# EAGLE schematic RCR2 (EAGLE 9.5.2)
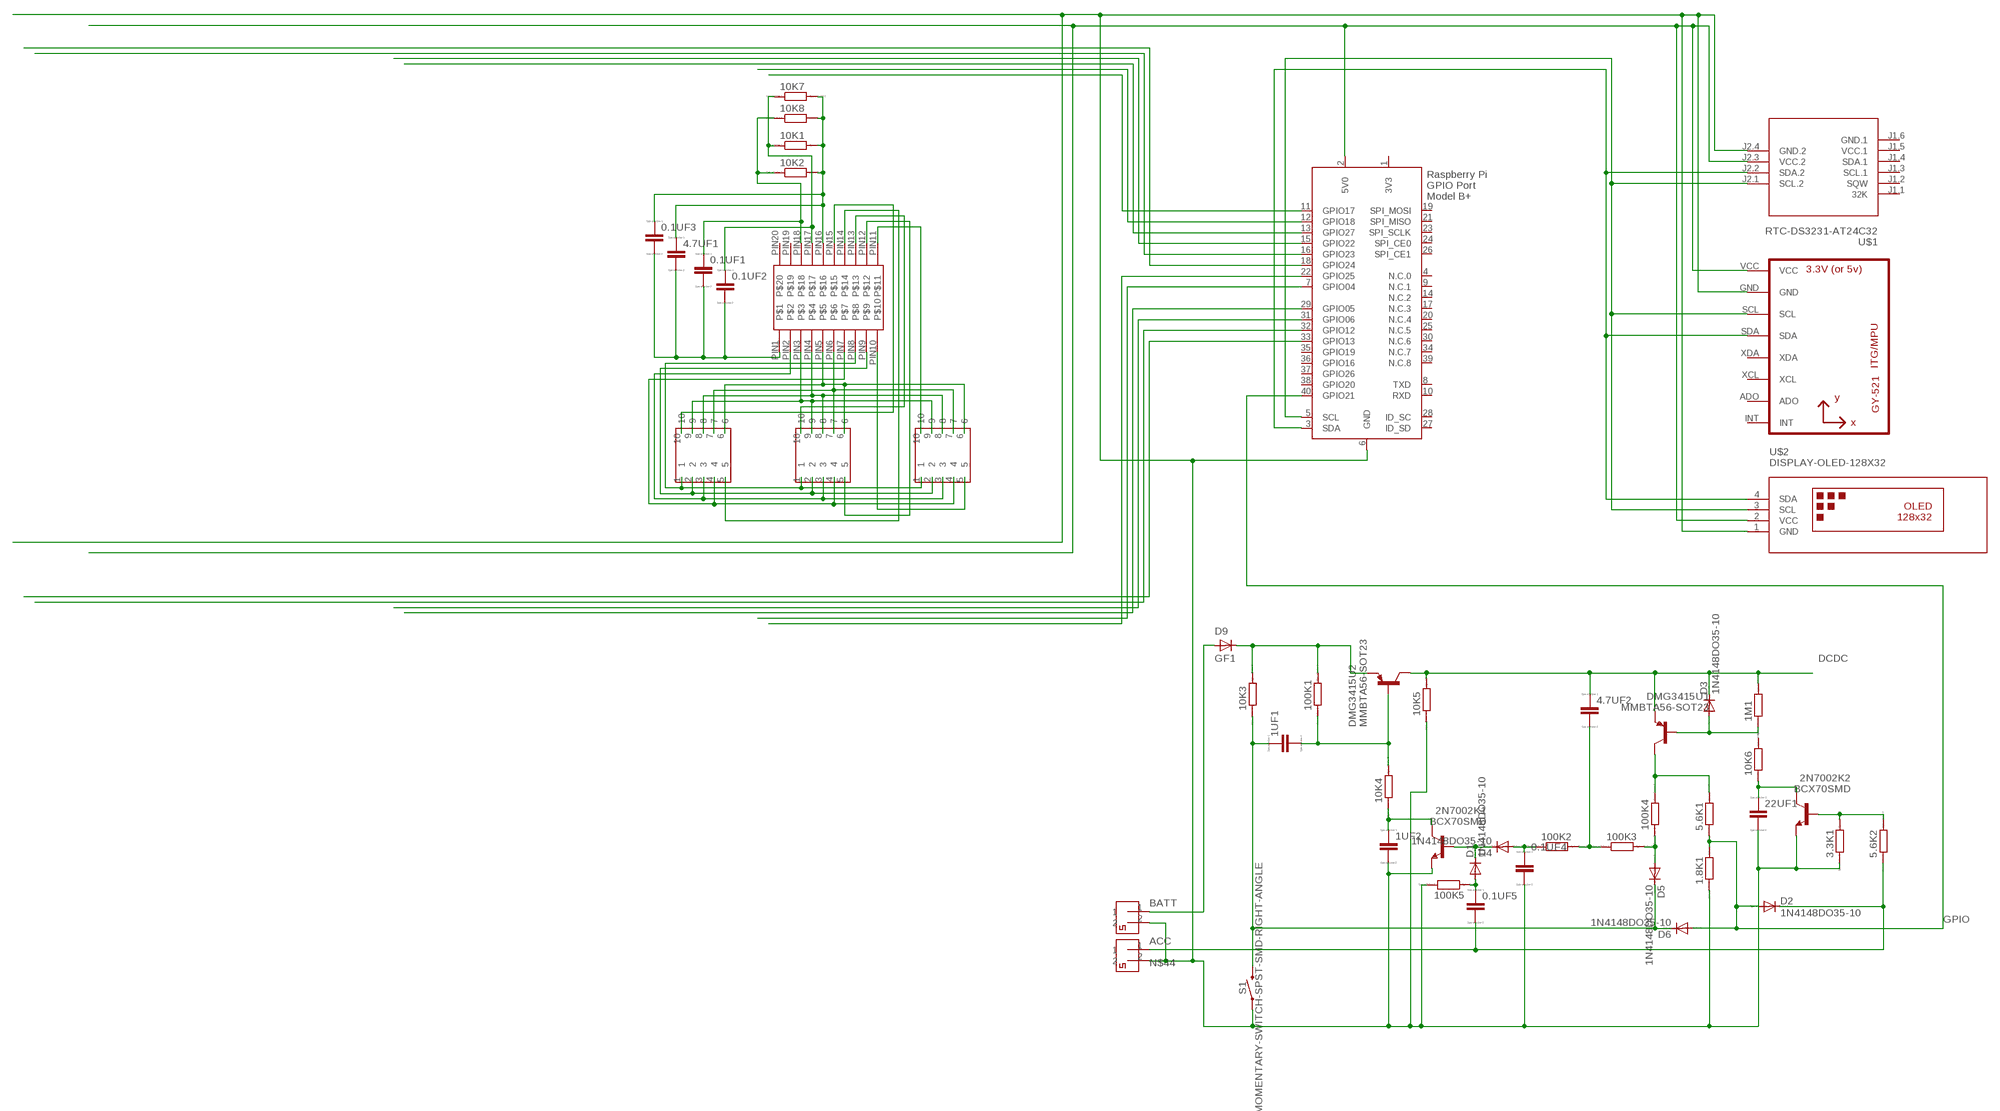
[diagram p0: schematic, sheet 1]

## Parts
0.1UF1  CC1206  [C1206]
0.1UF2  CC1206  [C1206]
0.1UF3  CC1206  [C1206]
0.1UF4  CC1206  [C1206]
0.1UF5  CC1206  [C1206]
1.8K1  RR1206  [R1206]
1M1  RR1206  [R1206]
1UF1  CC0603  [C0603]
1UF2  CC0603  [C0603]
2N7002K1  BCX70SMD  [SOT23]
2N7002K2  BCX70SMD  [SOT23]
3.3K1  RR1206  [R1206]
4.7UF1  CC2012  [C2012]
4.7UF2  CC2012  [C2012]
5.6K1  RR1206  [R1206]
5.6K2  RR1206  [R1206]
10K1  RR1206  [R1206]
10K2  RR1206  [R1206]
10K3  RR1206  [R1206]
10K4  RR1206  [R1206]
10K5  RR1206  [R1206]
10K6  RR1206  [R1206]
10K7  RR1206  [R1206]
10K8  RR1206  [R1206]
22UF1  C  [C0805]
100K1  RR1206  [R1206]
100K2  RR1206  [R1206]
100K3  RR1206  [R1206]
100K4  RR1206  [R1206]
100K5  RR1206  [R1206]
CONNECTOR2  2PIN  [2PIN]
CONNECTOR3  2PIN  [2PIN]
D1  1N4148DO35-10  [DO35-10]
D2  1N4148DO35-10  [DO35-10]
D3  1N4148DO35-10  [DO35-10]
D4  1N4148DO35-10  [DO35-10]
D5  1N4148DO35-10  [DO35-10]
D6  1N4148DO35-10  [DO35-10]
D9  GF1  [SMA-DO214AC]
DMG3415U1  MMBTA56-SOT23  [SOT23]
DMG3415U2  MMBTA56-SOT23  [SOT23]
LED1  7SEG  [7SEG]
LED2  7SEG  [7SEG]
LED3  7SEG  [7SEG]
S1  MOMENTARY-SWITCH-SPST-SMD-RIGHT-ANGLE  [TACTILE_SWITCH_SMD_RIGHT_ANGLE]
TM1637-SMD1  TM1637  [TM1637]
U1  GY-521MPU6050  [GY-521]
U$1  RTC-DS3231-AT24C32  [RTC-DS3231-AT24C32]
U$2  DISPLAY-OLED-128X32  [DISPLAY-OLED-128X32]
X1  RASPI_GPIO_B+_PIN  [RASPI_GPIO_B+_PIN]

## Nets
ACC: 0.1UF5.2 5.6K2.1 CONNECTOR2.1 D2.C
BATT: CONNECTOR3.1 D9.A
DCDC: 1M1.2 4.7UF2.1 10K5.2 D3.C DMG3415U1.2(E) DMG3415U2.3(C)
GPIO: 1.8K1.2 5.6K1.1 D2.A D6.A X1.40(GPIO21)
N$1: LED1.1 LED2.1 LED3.1 TM1637-SMD1.PIN8
N$2: LED1.2 LED2.2 LED3.2 TM1637-SMD1.PIN9
N$3: LED1.3 LED2.3 LED3.3 TM1637-SMD1.PIN2
N$4: X1.11(GPIO17)
N$5: X1.12(GPIO18)
N$6: LED1.4 LED2.4 LED3.4 TM1637-SMD1.PIN7
N$7: X1.22(GPIO25)
N$8: LED1.6 LED2.6 LED3.6 TM1637-SMD1.PIN5
N$9: LED1.7 LED2.7 LED3.7 TM1637-SMD1.PIN6
N$10: X1.7(GPIO04)
N$11: LED1.8 LED2.8 LED3.8 TM1637-SMD1.PIN4
N$12: LED1.9 LED2.9 LED3.9 TM1637-SMD1.PIN3
N$13: LED3.5 TM1637-SMD1.PIN10
N$14: LED3.10 TM1637-SMD1.PIN11
N$15: LED2.5 TM1637-SMD1.PIN12
N$16: LED2.10 TM1637-SMD1.PIN13
N$17: LED1.5 TM1637-SMD1.PIN14
N$18: LED1.10 TM1637-SMD1.PIN15
N$19: 0.1UF1.1 10K2.1 10K8.1 TM1637-SMD1.PIN18
N$20: 0.1UF2.1 10K1.1 10K7.1 TM1637-SMD1.PIN17
N$21: 0.1UF3.1 4.7UF1.1 10K1.2 10K2.2 10K7.2 10K8.2 TM1637-SMD1.PIN16
N$22: 0.1UF1.2 0.1UF2.2 0.1UF3.2 4.7UF1.2 TM1637-SMD1.PIN1
N$34: U1.SCL U$1.J2.1(SCL.2) U$2.3(SCL) X1.5(SCL)
N$44: 0.1UF4.2 1.8K1.1 1UF2.2 2N7002K1.2(E) 2N7002K2.2(E) 3.3K1.1 10K5.1 22UF1.2 100K5.2 CONNECTOR2.2 CONNECTOR3.2 S1.1 U1.GND U$1.J2.4(GND.2) U$2.1(GND) X1.6(GND)
N$61: X1.13(GPIO27)
N$62: X1.15(GPIO22)
N$68: U1.SDA U$1.J2.2(SDA.2) U$2.4(SDA) X1.3(SDA)
N$81: X1.31(GPIO06)
N$98: X1.16(GPIO23)
N$99: X1.18(GPIO24)
N$103: 10K3.2 100K1.2 D9.K(C) DMG3415U2.2(E)
N$104: 1UF1.1 10K3.1 D5.C D6.C S1.2
N$105: 1UF1.2 10K4.2 100K1.1 DMG3415U2.1(B)
N$106: 1UF2.1 2N7002K1.3(C) 10K4.1
N$107: 2N7002K1.1(B) D1.C D4.C
N$108: 0.1UF4.1 100K2.1 D4.A
N$110: 4.7UF2.2 100K2.2 100K3.1
N$111: 5.6K1.2 100K4.2 DMG3415U1.3(C)
N$112: X1.29(GPIO05)
N$113: 100K3.2 100K4.1 D5.A
N$115: 0.1UF5.1 100K5.1 D1.A
N$116: 1M1.1 D3.A DMG3415U1.1(B)
N$117: 2N7002K2.3(C) 10K6.1 22UF1.1
N$118: 2N7002K2.1(B) 3.3K1.2 5.6K2.2
N$133: X1.32(GPIO12)
N$134: X1.33(GPIO13)
VDD: U1.VCC U$1.J2.3(VCC.2) U$2.2(VCC) X1.2(5V0)
Unconnected: 10K6.2 TM1637-SMD1.PIN19 TM1637-SMD1.PIN20 U1.ADO U1.INT U1.XCL U1.XDA U$1.J1.1(32K) U$1.J1.2(SQW) U$1.J1.3(SCL.1) U$1.J1.4(SDA.1) X1.4(N.C.0) X1.8(TXD) X1.9(N.C.1) X1.10(RXD) X1.14(N.C.2) X1.17(N.C.3) X1.19(SPI_MOSI) X1.20(N.C.4) X1.21(SPI_MISO) X1.23(SPI_SCLK) X1.24(SPI_CE0) X1.25(N.C.5) X1.26(SPI_CE1) X1.27(ID_SD) X1.28(ID_SC) X1.30(N.C.6) X1.34(N.C.7) X1.35(GPIO19) X1.36(GPIO16) X1.37(GPIO26) X1.38(GPIO20) X1.39(N.C.8)

## Power pins joined to a net without a drawn wire
3V3: X1.1(3V3)
GND.1: U$1.J1.6(GND.1)
VCC.1: U$1.J1.5(VCC.1)

## Library data of the parts
0.1UF1-0.1UF5 1UF1 1UF2 4.7UF1 4.7UF2 22UF1 = eagle-ltspice:C: CAPACITOR, European symbol; SPICEMODEL: NONE; SPICEPREFIX: C
1.8K1 1M1 3.3K1 5.6K1 5.6K2 10K1-10K8 100K1-100K5 = eagle-ltspice:R: RESISTOR, European symbol; SPICEMODEL: NONE; SPICEPREFIX: R
2N7002K1 2N7002K2 = transistor-npn:BCX70*: NPN Transistor
CONNECTOR2 CONNECTOR3 = 2pin_small:2PIN: 2pin
D1-D6 = diode:1N4148: DIODE high speed (Philips)
D9 = diode:GF1: DIODE
DMG3415U1 DMG3415U2 = transistor-pnp:*-?: PNP Transistor
LED1-LED3 = 7seg-led:7SEG: 7seg
S1 = SparkFun-Switches:MOMENTARY-SWITCH-SPST: Momentary Switch (Pushbutton) - SPST Normally-open (NO) SPST momentary switches (buttons, pushbuttons). Variants PTH-12MM - 12mm square, through-hole Momentary Pushbutton Switch - 12mm Square <https://www.sparkfun.com/products/9190> (COM-09190) PTH-6.0MM, PTH-6.0MM-KIT - 6.0mm square, through-hole Mini Pushbutton Switch <https://www.sparkfun.com/products/97> (COM-00097) KIT package intended for soldering kit's - only one side of pads' copper is exposed. PTH-RIGHT-ANGLE-KIT - Right-angle, through-hole Right Angle Tactile Button <https://www.sparkfun.com/products/10791> - Used on SparkFun BigTime Watch Kit <https://www.sparkfun.com/products/11734> SMD-12MM - 12mm square, surface-mount Tactile Button - SMD (12mm) <https://www.sparkfun.com/products/12993> (COM-12993) Used on SparkFun PicoBoard <https://www.sparkfun.com/products/11888> SMD-4.5MM - 4.5mm Square Trackball Switch Used on SparkFun Blackberry Trackballer Breakout <https://www.sparkfun.com/products/13169> SMD-4.6MMX2.8MM - 4.60mm x 2.80mm, surface mount Used on SparkFun SAMD21 Mini Breakout <https://www.sparkfun.com/products/13664> SMD-5.2MM, SMD-5.2-REDUNDANT - 5.2mm square, surface-mount Mini Pushbutton Switch - SMD <https://www.sparkfun.com/products/8720> (COM-08720) Used on Arduino Pro Mini <https://www.sparkfun.com/products/11114> REDUNDANT package connects both switch circuits together SMD-6.0X3.5MM - 6.0 x 3.5mm, surface mount Momentary Reset Switch SMD <https://www.sparkfun.com/products/8229> (COM-08229) SMD-6.2MM-TALL - 6.2mm square, surface mount Tactile Button - SMD (6mm) <https://www.sparkfun.com/products/12992> Used on SparkFun Digital Sandbox <https://www.sparkfun.com/products/12651> SMD-RIGHT-ANGLE - Right-angle, surface mount Used on SparkFun Block for Intel® Edison - Arduino <https://www.sparkfun.com/products/13036>; PROD_ID: COMP-12265
TM1637-SMD1 = tm1637:TM1637: TM1637-smd library
U1 = gy-521:GY-521
U$1 = diy-modules:RTC-DS3231-AT24C32: RTC Module with Battery and EEPROM based on DS3231 and AT24C32 chips Tutorial can be found here: https://edwardmallon.wordpress.com/2014/05/21/using-a-cheap-3-ds3231-rtc-at24c32-eeprom-from-ebay/ Click here to find device on ebay.com <http://www.ebay.com/sch/DS3231+AT24C32+module>
U$2 = diy-modules:DISPLAY-OLED-128X32: 128x32 Dot Matrix OLED Module with I2C interface based on SSD1306 chip More details available here: http://www.tinyosshop.com/index.php?route=product/product&product_id=953 Schematic available here: http://www.tinyosshop.com/datasheet/OLED%2012832.pdf SSD1306 datasheet: https://cdn-shop.adafruit.com/datasheets/SSD1306.pdf Click here to find device on ebay.com <http://www.ebay.com/sch/oled+display+128x32+i2c>
X1 = raspberrypi_bastelstube_v13:RASPI_GPIO_B+: Only the 2x20 header connector, nothing else